# Altium schematic sheet qdr0_1.SchDoc: Virtex-6 QDRs 0 & 1
size A3; Date: DO NOT USE, RATHER USE PROJ OPTIONS; DrawnBy: DO NOT USE, RATHER USE PROJ OPTIONS; Engineer: DO NOT USE, RATHER USE PROJ OPTIONS; Organization: DO NOT USE, RATHER USE PROJ OPTIONS; DocumentNumber: DO NOT USE, RATHER USE PROJ OPTIONS; Revision: DO NOT USE, RATHER USE PROJ OPTIONS; SheetNumber: 19; SheetTotal: 29; SCH_Sheet_Filename: qdr0_1.SchDoc; CurrentTime: DO NOT USE, RATHER USE PROJ OPTIONS; Time: DO NOT USE, RATHER USE PROJ OPTIONS; DocumentFullPathAndName: DO NOT USE, RATHER USE PROJ OPTIONS; DocumentName: DO NOT USE, RATHER USE PROJ OPTIONS; ModifiedDate: DO NOT USE, RATHER USE PROJ OPTIONS; ImagePath: DO NOT USE, RATHER USE PROJ OPTIONS
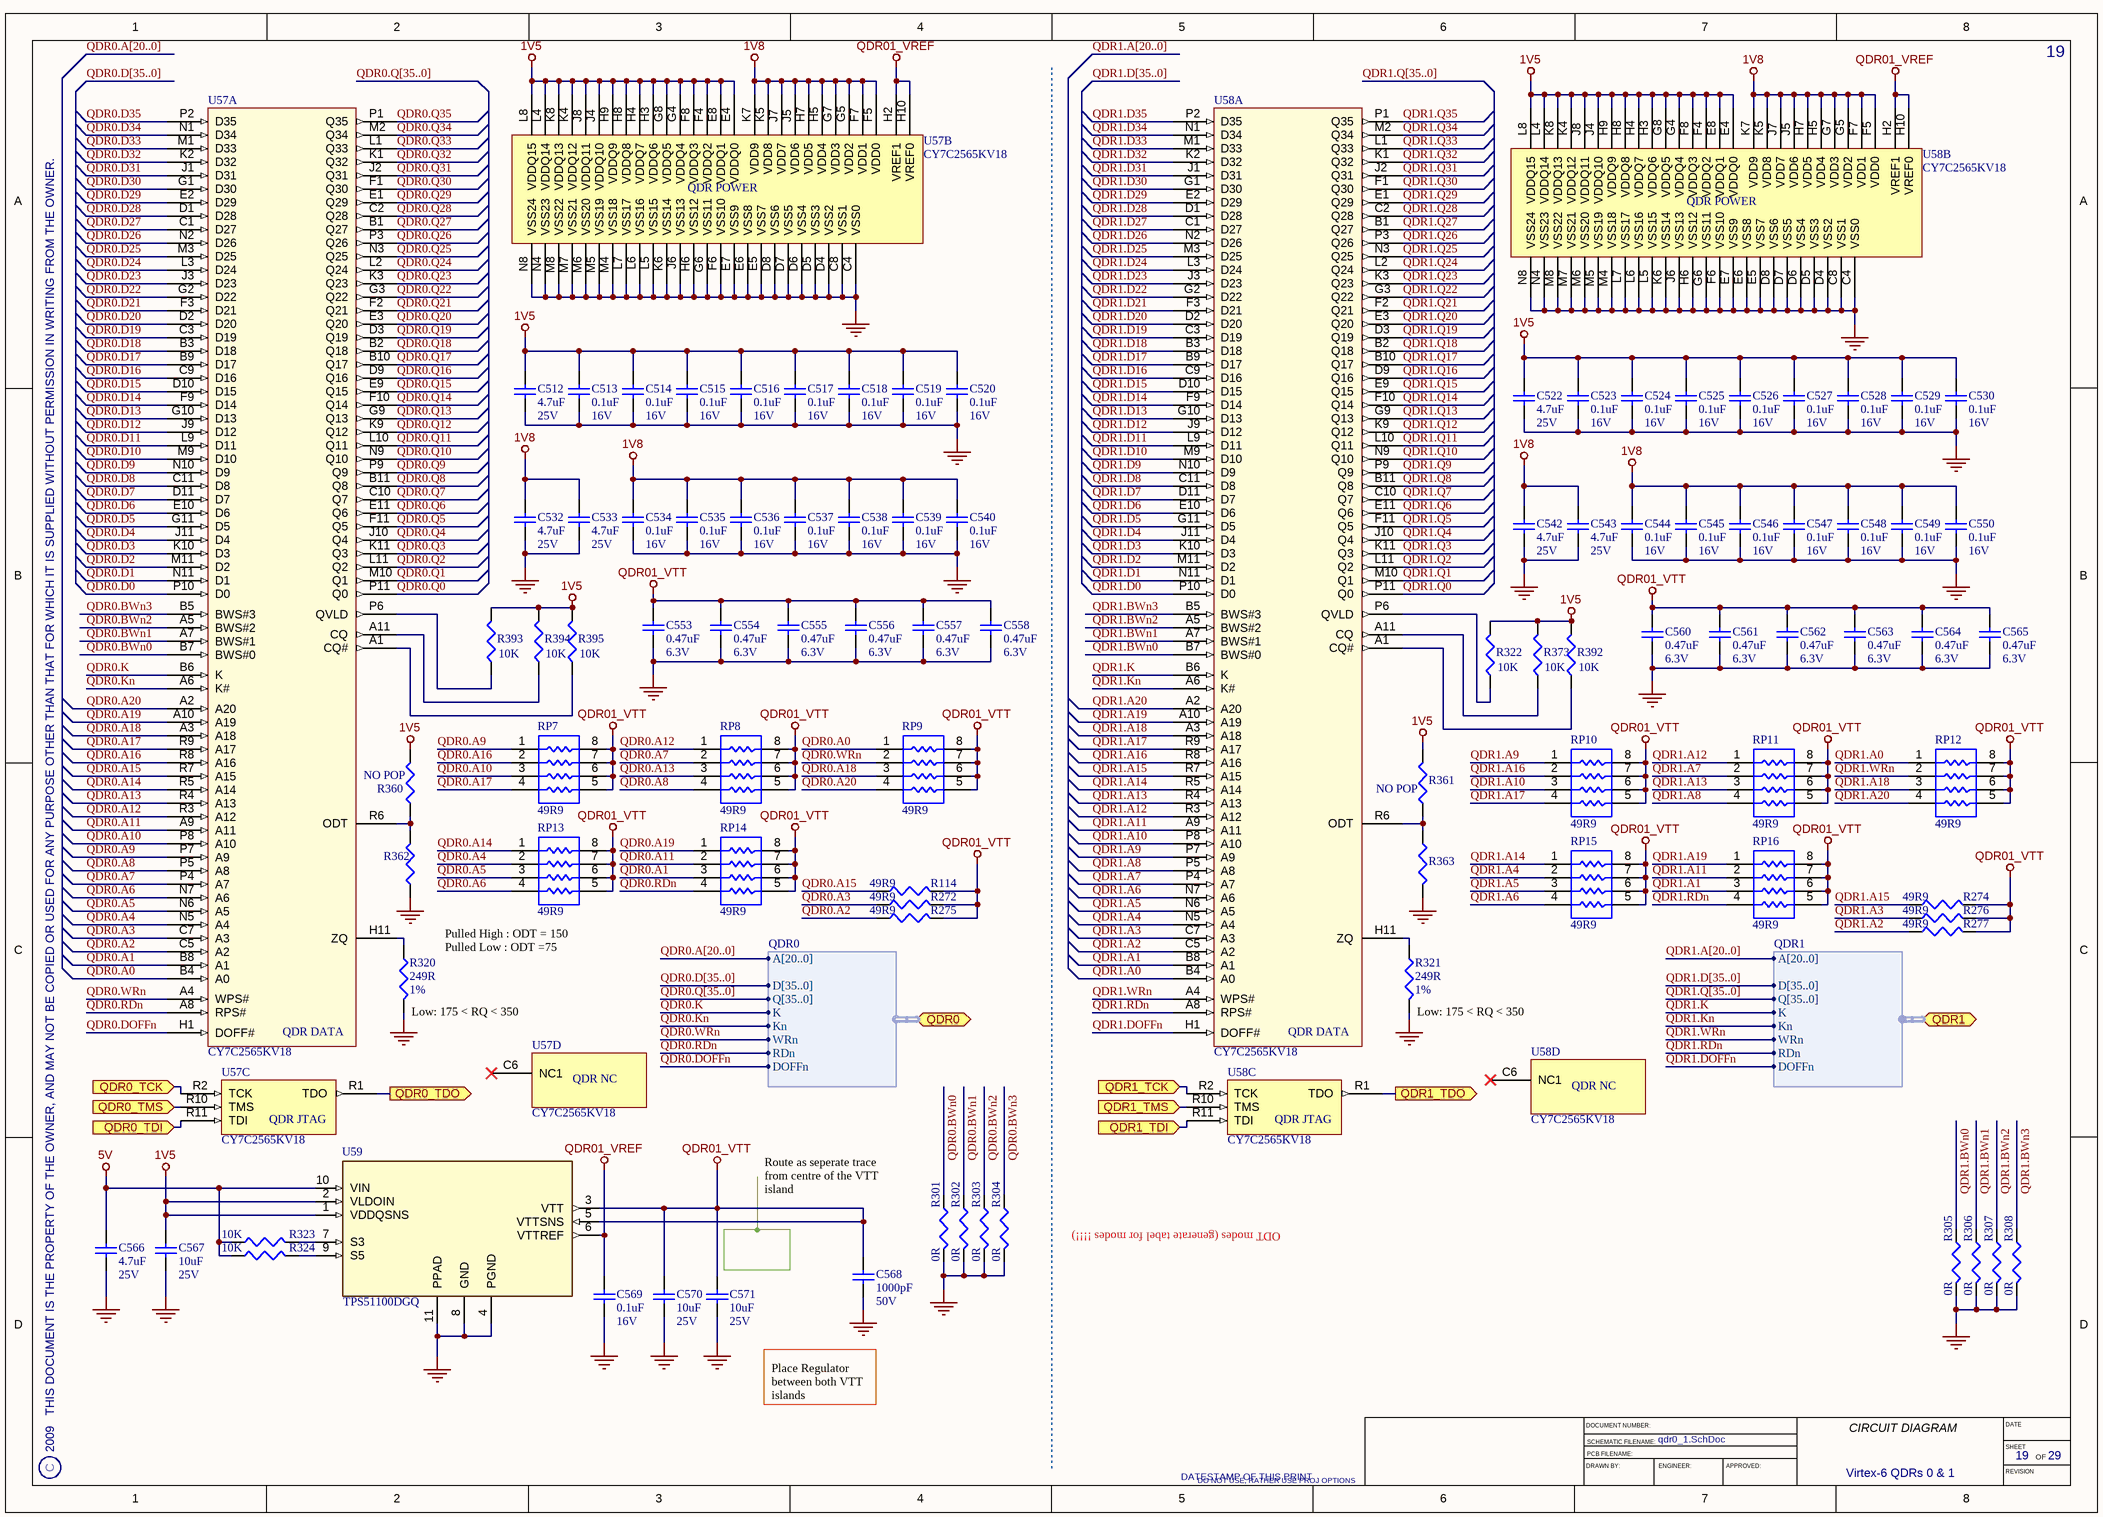
[diagram p0: qdr0_1.SchDoc]

## Parts
C512  Rating: 25V  [CAPC2012X127L]  (hidden comment: 4.7uF)
C513  Rating: 16V  [CAPC1005X60L]  (hidden comment: 0.1uF)
C514  Rating: 16V  [CAPC1005X60L]  (hidden comment: 0.1uF)
C515  Rating: 16V  [CAPC1005X60L]  (hidden comment: 0.1uF)
C516  Rating: 16V  [CAPC1005X60L]  (hidden comment: 0.1uF)
C517  Rating: 16V  [CAPC1005X60L]  (hidden comment: 0.1uF)
C518  Rating: 16V  [CAPC1005X60L]  (hidden comment: 0.1uF)
C519  Rating: 16V  [CAPC1005X60L]  (hidden comment: 0.1uF)
C520  Rating: 16V  [CAPC1005X60L]  (hidden comment: 0.1uF)
C522  Rating: 25V  [CAPC2012X127L]  (hidden comment: 4.7uF)
C523  Rating: 16V  [CAPC1005X60L]  (hidden comment: 0.1uF)
C524  Rating: 16V  [CAPC1005X60L]  (hidden comment: 0.1uF)
C525  Rating: 16V  [CAPC1005X60L]  (hidden comment: 0.1uF)
C526  Rating: 16V  [CAPC1005X60L]  (hidden comment: 0.1uF)
C527  Rating: 16V  [CAPC1005X60L]  (hidden comment: 0.1uF)
C528  Rating: 16V  [CAPC1005X60L]  (hidden comment: 0.1uF)
C529  Rating: 16V  [CAPC1005X60L]  (hidden comment: 0.1uF)
C530  Rating: 16V  [CAPC1005X60L]  (hidden comment: 0.1uF)
C532  Rating: 25V  [CAPC2012X127L]  (hidden comment: 4.7uF)
C533  Rating: 25V  [CAPC2012X127L]  (hidden comment: 4.7uF)
C534  Rating: 16V  [CAPC1005X60L]  (hidden comment: 0.1uF)
C535  Rating: 16V  [CAPC1005X60L]  (hidden comment: 0.1uF)
C536  Rating: 16V  [CAPC1005X60L]  (hidden comment: 0.1uF)
C537  Rating: 16V  [CAPC1005X60L]  (hidden comment: 0.1uF)
C538  Rating: 16V  [CAPC1005X60L]  (hidden comment: 0.1uF)
C539  Rating: 16V  [CAPC1005X60L]  (hidden comment: 0.1uF)
C540  Rating: 16V  [CAPC1005X60L]  (hidden comment: 0.1uF)
C542  Rating: 25V  [CAPC2012X127L]  (hidden comment: 4.7uF)
C543  Rating: 25V  [CAPC2012X127L]  (hidden comment: 4.7uF)
C544  Rating: 16V  [CAPC1005X60L]  (hidden comment: 0.1uF)
C545  Rating: 16V  [CAPC1005X60L]  (hidden comment: 0.1uF)
C546  Rating: 16V  [CAPC1005X60L]  (hidden comment: 0.1uF)
C547  Rating: 16V  [CAPC1005X60L]  (hidden comment: 0.1uF)
C548  Rating: 16V  [CAPC1005X60L]  (hidden comment: 0.1uF)
C549  Rating: 16V  [CAPC1005X60L]  (hidden comment: 0.1uF)
C550  Rating: 16V  [CAPC1005X60L]  (hidden comment: 0.1uF)
C553  Rating: 6.3V  [CAPC1005X55L]  (hidden comment: 0.47uF)
C554  Rating: 6.3V  [CAPC1005X55L]  (hidden comment: 0.47uF)
C555  Rating: 6.3V  [CAPC1005X55L]  (hidden comment: 0.47uF)
C556  Rating: 6.3V  [CAPC1005X55L]  (hidden comment: 0.47uF)
C557  Rating: 6.3V  [CAPC1005X55L]  (hidden comment: 0.47uF)
C558  Rating: 6.3V  [CAPC1005X55L]  (hidden comment: 0.47uF)
C560  Rating: 6.3V  [CAPC1005X55L]  (hidden comment: 0.47uF)
C561  Rating: 6.3V  [CAPC1005X55L]  (hidden comment: 0.47uF)
C562  Rating: 6.3V  [CAPC1005X55L]  (hidden comment: 0.47uF)
C563  Rating: 6.3V  [CAPC1005X55L]  (hidden comment: 0.47uF)
C564  Rating: 6.3V  [CAPC1005X55L]  (hidden comment: 0.47uF)
C565  Rating: 6.3V  [CAPC1005X55L]  (hidden comment: 0.47uF)
C566  Rating: 25V  [CAPC2012X127L]  (hidden comment: 4.7uF)
C567  Rating: 25V  [CAPC3225X200L]  (hidden comment: 10uF)
C568  Rating: 50V  [CAPC1005X55L]  (hidden comment: 1000pF)
C569  Rating: 16V  [CAPC1005X60L]  (hidden comment: 0.1uF)
C570  Rating: 25V  [CAPC3225X200L]  (hidden comment: 10uF)
C571  Rating: 25V  [CAPC3225X200L]  (hidden comment: 10uF)
R114  49R9  [RESC1005X40L]
R272  49R9  [RESC1005X40L]
R274  49R9  [RESC1005X40L]
R275  49R9  [RESC1005X40L]
R276  49R9  [RESC1005X40L]
R277  49R9  [RESC1005X40L]
R301  0R  [RESC1005X40L]
R302  0R  [RESC1005X40L]
R303  0R  [RESC1005X40L]
R304  0R  [RESC1005X40L]
R305  0R  [RESC1005X40L]
R306  0R  [RESC1005X40L]
R307  0R  [RESC1005X40L]
R308  0R  [RESC1005X40L]
R320  Tolerance: 1%  [RESC1005X40L]  (hidden comment: 249R)
R321  Tolerance: 1%  [RESC1005X40L]  (hidden comment: 249R)
R322  10K  [RESC1005X40L]
R323  10K  [RESC1005X40L]
R324  10K  [RESC1005X40L]
R360  10K  [RESC1005X40L]  (value not drawn)
R361  10K  [RESC1005X40L]  (value not drawn)
R362  10K  [RESC1005X40L]  (value not drawn)
R363  10K  [RESC1005X40L]  (value not drawn)
R373  10K  [RESC1005X40L]
R392  10K  [RESC1005X40L]
R393  10K  [RESC1005X40L]
R394  10K  [RESC1005X40L]
R395  10K  [RESC1005X40L]
RP7  49R9  [RESCAV50P100X200X45-8L]
RP8  49R9  [RESCAV50P100X200X45-8L]
RP9  49R9  [RESCAV50P100X200X45-8L]
RP10  49R9  [RESCAV50P100X200X45-8L]
RP11  49R9  [RESCAV50P100X200X45-8L]
RP12  49R9  [RESCAV50P100X200X45-8L]
RP13  49R9  [RESCAV50P100X200X45-8L]
RP14  49R9  [RESCAV50P100X200X45-8L]
RP15  49R9  [RESCAV50P100X200X45-8L]
RP16  49R9  [RESCAV50P100X200X45-8L]
U57  CY7C2565KV18  [FBGA_165-Ball]  (parts A,B,C,D of 4)
U58  CY7C2565KV18  [FBGA_165-Ball]  (parts A,B,C,D of 4)
U59  TPS51100DGQ  [MSOP_10-N]

## Ports
QDR0 (harness QDR0), QDR0_TCK (in), QDR0_TDI (in), QDR0_TDO (out), QDR0_TMS (in), QDR1 (harness QDR1), QDR1_TCK (in), QDR1_TDI (in), QDR1_TDO (out), QDR1_TMS (in)

## Harnesses
QDR0: A[20..0], D[35..0], Q[35..0], K, Kn, WRn, RDn, DOFFn
QDR1: A[20..0], D[35..0], Q[35..0], K, Kn, WRn, RDn, DOFFn

## Nets
1V5: C512.2 C513.2 C514.2 C515.2 C516.2 C517.2 C518.2 C519.2 C520.2 C522.2 C523.2 C524.2 C525.2 C526.2 C527.2 C528.2 C529.2 C530.2 C567.2 R322.2 R360.2 R361.2 R373.2 R392.2 R393.2 R394.2 R395.2 U57.E4(VDDQ0) U57.E8(VDDQ1) U57.F4(VDDQ2) U57.F8(VDDQ3) U57.G4(VDDQ4) U57.G8(VDDQ5) U57.H3(VDDQ6) U57.H4(VDDQ7) U57.H8(VDDQ8) U57.H9(VDDQ9) U57.J4(VDDQ10) U57.J8(VDDQ11) U57.K4(VDDQ12) U57.K8(VDDQ13) U57.L4(VDDQ14) U57.L8(VDDQ15) U58.E4(VDDQ0) U58.E8(VDDQ1) U58.F4(VDDQ2) U58.F8(VDDQ3) U58.G4(VDDQ4) U58.G8(VDDQ5) U58.H3(VDDQ6) U58.H4(VDDQ7) U58.H8(VDDQ8) U58.H9(VDDQ9) U58.J4(VDDQ10) U58.J8(VDDQ11) U58.K4(VDDQ12) U58.K8(VDDQ13) U58.L4(VDDQ14) U58.L8(VDDQ15) U59.1(VDDQSNS) U59.2(VLDOIN)
1V8: C532.2 C533.2 C534.2 C535.2 C536.2 C537.2 C538.2 C539.2 C540.2 C542.2 C543.2 C544.2 C545.2 C546.2 C547.2 C548.2 C549.2 C550.2 U57.F5(VDD0) U57.F7(VDD1) U57.G5(VDD2) U57.G7(VDD3) U57.H5(VDD4) U57.H7(VDD5) U57.J5(VDD6) U57.J7(VDD7) U57.K5(VDD8) U57.K7(VDD9) U58.F5(VDD0) U58.F7(VDD1) U58.G5(VDD2) U58.G7(VDD3) U58.H5(VDD4) U58.H7(VDD5) U58.J5(VDD6) U58.J7(VDD7) U58.K5(VDD8) U58.K7(VDD9)
5V: C566.2 R323.1 R324.1 U59.10(VIN)
GND: C512.1 C513.1 C514.1 C515.1 C516.1 C517.1 C518.1 C519.1 C520.1 C522.1 C523.1 C524.1 C525.1 C526.1 C527.1 C528.1 C529.1 C530.1 C532.1 C533.1 C534.1 C535.1 C536.1 C537.1 C538.1 C539.1 C540.1 C542.1 C543.1 C544.1 C545.1 C546.1 C547.1 C548.1 C549.1 C550.1 C553.1 C554.1 C555.1 C556.1 C557.1 C558.1 C560.1 C561.1 C562.1 C563.1 C564.1 C565.1 C566.1 C567.1 C568.1 C569.1 C570.1 C571.1 R301.2 R302.2 R303.2 R304.2 R305.2 R306.2 R307.2 R308.2 R320.2 R321.2 R362.1 R363.2 U57.C4(VSS0) U57.C8(VSS1) U57.D4(VSS2) U57.D5(VSS3) U57.D6(VSS4) U57.D7(VSS5) U57.D8(VSS6) U57.E5(VSS7) U57.E6(VSS8) U57.E7(VSS9) U57.F6(VSS10) U57.G6(VSS11) U57.H6(VSS12) U57.J6(VSS13) U57.K6(VSS14) U57.L5(VSS15) U57.L6(VSS16) U57.L7(VSS17) U57.M4(VSS18) U57.M5(VSS19) U57.M6(VSS20) U57.M7(VSS21) U57.M8(VSS22) U57.N4(VSS23) U57.N8(VSS24) U58.C4(VSS0) U58.C8(VSS1) U58.D4(VSS2) U58.D5(VSS3) U58.D6(VSS4) U58.D7(VSS5) U58.D8(VSS6) U58.E5(VSS7) U58.E6(VSS8) U58.E7(VSS9) U58.F6(VSS10) U58.G6(VSS11) U58.H6(VSS12) U58.J6(VSS13) U58.K6(VSS14) U58.L5(VSS15) U58.L6(VSS16) U58.L7(VSS17) U58.M4(VSS18) U58.M5(VSS19) U58.M6(VSS20) U58.M7(VSS21) U58.M8(VSS22) U58.N4(VSS23) U58.N8(VSS24) U59.4(PGND) U59.8(GND) U59.11(PPAD)
QDR01_VREF: C569.2 U57.H2(VREF1) U57.H10(VREF0) U58.H2(VREF1) U58.H10(VREF0) U59.6(VTTREF)
QDR01_VTT: C553.2 C554.2 C555.2 C556.2 C557.2 C558.2 C560.2 C561.2 C562.2 C563.2 C564.2 C565.2 C568.2 C570.2 C571.2 R114.2 R272.2 R274.2 R275.2 R276.2 R277.2 RP7.5 RP7.6 RP7.7 RP7.8 RP8.5 RP8.6 RP8.7 RP8.8 RP9.5 RP9.6 RP9.7 RP9.8 RP10.5 RP10.6 RP10.7 RP10.8 RP11.5 RP11.6 RP11.7 RP11.8 RP12.5 RP12.6 RP12.7 RP12.8 RP13.5 RP13.6 RP13.7 RP13.8 RP14.5 RP14.6 RP14.7 RP14.8 RP15.5 RP15.6 RP15.7 RP15.8 RP16.5 RP16.6 RP16.7 RP16.8 U59.3(VTT) U59.5(VTTSNS)
QDR0.A0: RP9.1 U57.B4(A0)
QDR0.A1: RP14.3 U57.B8(A1)
QDR0.A2: R275.1 U57.C5(A2)
QDR0.A3: R272.1 U57.C7(A3)
QDR0.A4: RP13.2 U57.N5(A4)
QDR0.A5: RP13.3 U57.N6(A5)
QDR0.A6: RP13.4 U57.N7(A6)
QDR0.A7: RP8.2 U57.P4(A7)
QDR0.A8: RP8.4 U57.P5(A8)
QDR0.A9: RP7.1 U57.P7(A9)
QDR0.A10: RP7.3 U57.P8(A10)
QDR0.A11: RP14.2 U57.A9(A11)
QDR0.A12: RP8.1 U57.R3(A12)
QDR0.A13: RP8.3 U57.R4(A13)
QDR0.A14: RP13.1 U57.R5(A14)
QDR0.A15: R114.1 U57.R7(A15)
QDR0.A16: RP7.2 U57.R8(A16)
QDR0.A17: RP7.4 U57.R9(A17)
QDR0.A18: RP9.3 U57.A3(A18)
QDR0.A19: RP14.1 U57.A10(A19)
QDR0.A20: RP9.4 U57.A2(A20)
QDR0.BWn0: R301.1 U57.B7(BWS#0)
QDR0.BWn1: R302.1 U57.A7(BWS#1)
QDR0.BWn2: R303.1 U57.A5(BWS#2)
QDR0.BWn3: R304.1 U57.B5(BWS#3)
QDR0.D0: U57.P10(D0)
QDR0.D1: U57.N11(D1)
QDR0.D2: U57.M11(D2)
QDR0.D3: U57.K10(D3)
QDR0.D4: U57.J11(D4)
QDR0.D5: U57.G11(D5)
QDR0.D6: U57.E10(D6)
QDR0.D7: U57.D11(D7)
QDR0.D8: U57.C11(D8)
QDR0.D9: U57.N10(D9)
QDR0.D10: U57.M9(D10)
QDR0.D11: U57.L9(D11)
QDR0.D12: U57.J9(D12)
QDR0.D13: U57.G10(D13)
QDR0.D14: U57.F9(D14)
QDR0.D15: U57.D10(D15)
QDR0.D16: U57.C9(D16)
QDR0.D17: U57.B9(D17)
QDR0.D18: U57.B3(D18)
QDR0.D19: U57.C3(D19)
QDR0.D20: U57.D2(D20)
QDR0.D21: U57.F3(D21)
QDR0.D22: U57.G2(D22)
QDR0.D23: U57.J3(D23)
QDR0.D24: U57.L3(D24)
QDR0.D25: U57.M3(D25)
QDR0.D26: U57.N2(D26)
QDR0.D27: U57.C1(D27)
QDR0.D28: U57.D1(D28)
QDR0.D29: U57.E2(D29)
QDR0.D30: U57.G1(D30)
QDR0.D31: U57.J1(D31)
QDR0.D32: U57.K2(D32)
QDR0.D33: U57.M1(D33)
QDR0.D34: U57.N1(D34)
QDR0.D35: U57.P2(D35)
QDR0.DOFFn: U57.H1(DOFF#) ; port QDR0.DOFFn
QDR0.K: U57.B6(K) ; port QDR0.K
QDR0.Kn: U57.A6(K#) ; port QDR0.Kn
QDR0.Q0: U57.P11(Q0)
QDR0.Q1: U57.M10(Q1)
QDR0.Q2: U57.L11(Q2)
QDR0.Q3: U57.K11(Q3)
QDR0.Q4: U57.J10(Q4)
QDR0.Q5: U57.F11(Q5)
QDR0.Q6: U57.E11(Q6)
QDR0.Q7: U57.C10(Q7)
QDR0.Q8: U57.B11(Q8)
QDR0.Q9: U57.P9(Q9)
QDR0.Q10: U57.N9(Q10)
QDR0.Q11: U57.L10(Q11)
QDR0.Q12: U57.K9(Q12)
QDR0.Q13: U57.G9(Q13)
QDR0.Q14: U57.F10(Q14)
QDR0.Q15: U57.E9(Q15)
QDR0.Q16: U57.D9(Q16)
QDR0.Q17: U57.B10(Q17)
QDR0.Q18: U57.B2(Q18)
QDR0.Q19: U57.D3(Q19)
QDR0.Q20: U57.E3(Q20)
QDR0.Q21: U57.F2(Q21)
QDR0.Q22: U57.G3(Q22)
QDR0.Q23: U57.K3(Q23)
QDR0.Q24: U57.L2(Q24)
QDR0.Q25: U57.N3(Q25)
QDR0.Q26: U57.P3(Q26)
QDR0.Q27: U57.B1(Q27)
QDR0.Q28: U57.C2(Q28)
QDR0.Q29: U57.E1(Q29)
QDR0.Q30: U57.F1(Q30)
QDR0.Q31: U57.J2(Q31)
QDR0.Q32: U57.K1(Q32)
QDR0.Q33: U57.L1(Q33)
QDR0.Q34: U57.M2(Q34)
QDR0.Q35: U57.P1(Q35)
QDR0.RDn: RP14.4 U57.A8(RPS#) ; port QDR0.RDn
QDR0.WRn: RP9.2 U57.A4(WPS#) ; port QDR0.WRn
QDR0_TCK: U57.R2(TCK) ; port QDR0_TCK
QDR0_TDI: U57.R11(TDI) ; port QDR0_TDI
QDR0_TDO: U57.R1(TDO) ; port QDR0_TDO
QDR0_TMS: U57.R10(TMS) ; port QDR0_TMS
QDR1.A0: RP12.1 U58.B4(A0)
QDR1.A1: RP16.3 U58.B8(A1)
QDR1.A2: R277.1 U58.C5(A2)
QDR1.A3: R276.1 U58.C7(A3)
QDR1.A4: RP15.2 U58.N5(A4)
QDR1.A5: RP15.3 U58.N6(A5)
QDR1.A6: RP15.4 U58.N7(A6)
QDR1.A7: RP11.2 U58.P4(A7)
QDR1.A8: RP11.4 U58.P5(A8)
QDR1.A9: RP10.1 U58.P7(A9)
QDR1.A10: RP10.3 U58.P8(A10)
QDR1.A11: RP16.2 U58.A9(A11)
QDR1.A12: RP11.1 U58.R3(A12)
QDR1.A13: RP11.3 U58.R4(A13)
QDR1.A14: RP15.1 U58.R5(A14)
QDR1.A15: R274.1 U58.R7(A15)
QDR1.A16: RP10.2 U58.R8(A16)
QDR1.A17: RP10.4 U58.R9(A17)
QDR1.A18: RP12.3 U58.A3(A18)
QDR1.A19: RP16.1 U58.A10(A19)
QDR1.A20: RP12.4 U58.A2(A20)
QDR1.BWn0: R305.1 U58.B7(BWS#0)
QDR1.BWn1: R306.1 U58.A7(BWS#1)
QDR1.BWn2: R307.1 U58.A5(BWS#2)
QDR1.BWn3: R308.1 U58.B5(BWS#3)
QDR1.D0: U58.P10(D0)
QDR1.D1: U58.N11(D1)
QDR1.D2: U58.M11(D2)
QDR1.D3: U58.K10(D3)
QDR1.D4: U58.J11(D4)
QDR1.D5: U58.G11(D5)
QDR1.D6: U58.E10(D6)
QDR1.D7: U58.D11(D7)
QDR1.D8: U58.C11(D8)
QDR1.D9: U58.N10(D9)
QDR1.D10: U58.M9(D10)
QDR1.D11: U58.L9(D11)
QDR1.D12: U58.J9(D12)
QDR1.D13: U58.G10(D13)
QDR1.D14: U58.F9(D14)
QDR1.D15: U58.D10(D15)
QDR1.D16: U58.C9(D16)
QDR1.D17: U58.B9(D17)
QDR1.D18: U58.B3(D18)
QDR1.D19: U58.C3(D19)
QDR1.D20: U58.D2(D20)
QDR1.D21: U58.F3(D21)
QDR1.D22: U58.G2(D22)
QDR1.D23: U58.J3(D23)
QDR1.D24: U58.L3(D24)
QDR1.D25: U58.M3(D25)
QDR1.D26: U58.N2(D26)
QDR1.D27: U58.C1(D27)
QDR1.D28: U58.D1(D28)
QDR1.D29: U58.E2(D29)
QDR1.D30: U58.G1(D30)
QDR1.D31: U58.J1(D31)
QDR1.D32: U58.K2(D32)
QDR1.D33: U58.M1(D33)
QDR1.D34: U58.N1(D34)
QDR1.D35: U58.P2(D35)
QDR1.DOFFn: U58.H1(DOFF#) ; port QDR1.DOFFn
QDR1.K: U58.B6(K) ; port QDR1.K
QDR1.Kn: U58.A6(K#) ; port QDR1.Kn
QDR1.Q0: U58.P11(Q0)
QDR1.Q1: U58.M10(Q1)
QDR1.Q2: U58.L11(Q2)
QDR1.Q3: U58.K11(Q3)
QDR1.Q4: U58.J10(Q4)
QDR1.Q5: U58.F11(Q5)
QDR1.Q6: U58.E11(Q6)
QDR1.Q7: U58.C10(Q7)
QDR1.Q8: U58.B11(Q8)
QDR1.Q9: U58.P9(Q9)
QDR1.Q10: U58.N9(Q10)
QDR1.Q11: U58.L10(Q11)
QDR1.Q12: U58.K9(Q12)
QDR1.Q13: U58.G9(Q13)
QDR1.Q14: U58.F10(Q14)
QDR1.Q15: U58.E9(Q15)
QDR1.Q16: U58.D9(Q16)
QDR1.Q17: U58.B10(Q17)
QDR1.Q18: U58.B2(Q18)
QDR1.Q19: U58.D3(Q19)
QDR1.Q20: U58.E3(Q20)
QDR1.Q21: U58.F2(Q21)
QDR1.Q22: U58.G3(Q22)
QDR1.Q23: U58.K3(Q23)
QDR1.Q24: U58.L2(Q24)
QDR1.Q25: U58.N3(Q25)
QDR1.Q26: U58.P3(Q26)
QDR1.Q27: U58.B1(Q27)
QDR1.Q28: U58.C2(Q28)
QDR1.Q29: U58.E1(Q29)
QDR1.Q30: U58.F1(Q30)
QDR1.Q31: U58.J2(Q31)
QDR1.Q32: U58.K1(Q32)
QDR1.Q33: U58.L1(Q33)
QDR1.Q34: U58.M2(Q34)
QDR1.Q35: U58.P1(Q35)
QDR1.RDn: RP16.4 U58.A8(RPS#) ; port QDR1.RDn
QDR1.WRn: RP12.2 U58.A4(WPS#) ; port QDR1.WRn
QDR1_TCK: U58.R2(TCK) ; port QDR1_TCK
QDR1_TDI: U58.R11(TDI) ; port QDR1_TDI
QDR1_TDO: U58.R1(TDO) ; port QDR1_TDO
QDR1_TMS: U58.R10(TMS) ; port QDR1_TMS
NetR320_1: R320.1 U57.H11(ZQ)
NetR321_1: R321.1 U58.H11(ZQ)
NetR322_1: R322.1 U58.P6(QVLD)
NetR323_2: R323.2 U59.7(S3)
NetR324_2: R324.2 U59.9(S5)
NetR360_1: R360.1 R362.2 U57.R6(ODT)
NetR361_1: R361.1 R363.1 U58.R6(ODT)
NetR373_1: R373.1 U58.A11(CQ)
NetR392_1: R392.1 U58.A1(CQ#)
NetR393_1: R393.1 U57.P6(QVLD)
NetR394_1: R394.1 U57.A11(CQ)
NetR395_1: R395.1 U57.A1(CQ#)

Not connected (* = marked no-connect by the designer): U57 C6(NC1)*; U58 C6(NC1)*

## Buses and harness runs
bus QDR0.A[20..0]
bus QDR0.D[35..0]
bus QDR0.Q[35..0]
bus QDR1.A[20..0]
bus QDR1.D[35..0]
bus QDR1.Q[35..0]

## Notes on the sheet
- NO POP
- Pulled High : ODT = 150
  Pulled Low : ODT =75
- (near R320) Low: 175 < RQ < 350
- (near R321) Low: 175 < RQ < 350
- Route as seperate trace from centre of the VTT island
- (near R304) ODT modes (generate tabel for modes !!!!)
- Place Regulator between both VTT islands
- 2009   THIS DOCUMENT IS THE PROPERTY OF THE OWNER, AND MAY NOT BE COPIED OR USED FOR ANY PURPOSE OTHER THAN THAT FOR WHICH IT IS SUPPLIED WITHOUT PERMISSION IN WRITING FROM THE OWNER.
- C
- DATESTAMP OF THIS PRINT
- DRAWN BY:
- DOCUMENT NUMBER:
- SCHEMATIC FILENAME:
- PCB FILENAME:
- ENGINEER:
- APPROVED:
- CIRCUIT DIAGRAM
- DATE
- SHEET
- REVISION
- OF
- (in symbol IC-MEM-1, part A) QDR DATA
- (in symbol IC-MEM-1, part B) QDR POWER
- (in symbol IC-MEM-1, part C) QDR JTAG
- (in symbol IC-MEM-1, part D) QDR NC

## Library data of the parts
C512 C522 C532 C533 C542 C543 C566 = CAP-CER-3: 4.7uF, Ceramic Capacitor; Manufacturer: MURATA; PartNum: GRM21BR61E475KA12K; Tolerance: 10%; Dielectric: X5R; POD number: CAP-CER-3; Value: 4.7uF; RoHS: Y; Sort Value: 4.7; Category: Capacitors; Subcategory: Ceramic
C513-C520 C523-C530 C534-C540 C544-C550 C569 = CAP-CER-1: 0.1uF, Ceramic Capacitor; Manufacturer: VENKEL; PartNum: C0402X7R160-104KN; Tolerance: 10%; Dielectric: X7R; POD number: CAP-CER-1; Value: 0.1uF; RoHS: Y; Sort Value: 0.1; Category: Capacitors; Subcategory: Ceramic
C553-C558 C560-C565 = CAP-CER-7: 0.47uF, Ceramic Capacitor; Manufacturer: MURATA; PartNum: GRM155R60J474KE19; Tolerance: 10%; Dielectric: X5R; POD number: CAP-CER-7; Value: 0.47uF; RoHS: Y; Sort Value: 0.47; Category: Capacitors; Subcategory: Ceramic
C567 C570 C571 = CAP-CER-5: 10uF, Ceramic Capacitor; Manufacturer: MURATA; PartNum: GRM32DR61E106KA12L; Tolerance: 10%; Dielectric: X5R; POD number: CAP-CER-5; Value: 10uF; RoHS: Y; Sort Value: 100; Category: Capacitors; Subcategory: Ceramic
C568 = CAP-CER-4: 1000pF, Ceramic Capacitor; Manufacturer: MURATA; PartNum: GRM155R61H102KA01D; Tolerance: 10%; Dielectric: X5R; POD number: CAP-CER-4; Value: 1000pF; RoHS: Y; Sort Value: 0.0001; Category: Capacitors; Subcategory: Ceramic
R114 R272 R274-R277 = RES-TF-10: 49R9, 1.1mm x 0.5mm, Thick Film Resistor; Manufacturer: ROYALOHM; PartNum: 0402WGF499JT1E; Tolerance: 1%; Rating: 0.0625W; POD number: RES-TF-10; Value: 49R9; Sort Value: 49.9; Category: Resistors; Subcategory: ThickFilm; HelpURL: *.pdf
R301-R308 = RES-TF-0: 0R, 1.1mm x 0.5mm, Thick Film Resistor; Manufacturer: ROYALOHM; PartNum: 0402WG00000T1E; Tolerance: 0%; Rating: 0.0625W; POD number: RES-TF-0; Value: 0R; Sort Value: 0; Category: Resistors; Subcategory: ThickFilm; HelpURL: *.pdf
R320 R321 = RES-TF-15: 249R, 1.1mm x 0.5mm, Thick Film Resistor; Manufacturer: ROYALOHM; PartNum: 0402WGF2490T1E; Rating: 0.0625W; POD number: RES-TF-15; Value: 249R; Sort Value: 249; Category: Resistors; Subcategory: ThickFilm; HelpURL: *.pdf
R322-R324 R360-R363 R373 R392-R395 = RES-TF-5: 10K, 1.1mm x 0.5mm, Thick Film Resistor; Manufacturer: ROYALOHM; PartNum: 0402WGJ0103T1E; Tolerance: 5%; Rating: 0.0625W; POD number: RES-TF-5; Value: 10K; Sort Value: 10000; Category: Resistors; Subcategory: ThickFilm
  R322 R360-R363 R373 R392-R395: RoHS: Y; HelpURL: http://www.royalohm.com/pdf/general.pdf
  R323 R324: HelpURL: *.pdf
RP7-RP16 = RES-TF-39: 4-Wide, Isolated, Thick Film Resistor Network; Manufacturer: ROYALOHM; PartNum: 4D02WGJ0510B1E; Tolerance: 1%; Rating: 0.0625W; POD number: RES-TF-39; Value: 49R9; Sort Value: 49.9; Category: Resistors; Subcategory: ThickFilm
U57 U58 = IC-MEM-1: 72Mb, 36-Bit wide, QDR2+ Synchronous SRAM with ODT; Manufacturer: Cypress; PartNum: CY7C2565KV18-450BZXC; POD number: IC-MEM-1; RoHS: Y; Category: IC; Subcategory: Memory
U59 = IC-REG-6: 3A Sink/Source Regulator; Manufacturer: Texas Instruments; POD number: IC-REG-6; PartNum: TPS51100DGQ; RoHS: Y; Category: IC; Subcategory: Regulators